# Altium schematic sheet MISC.SchDoc
size A3
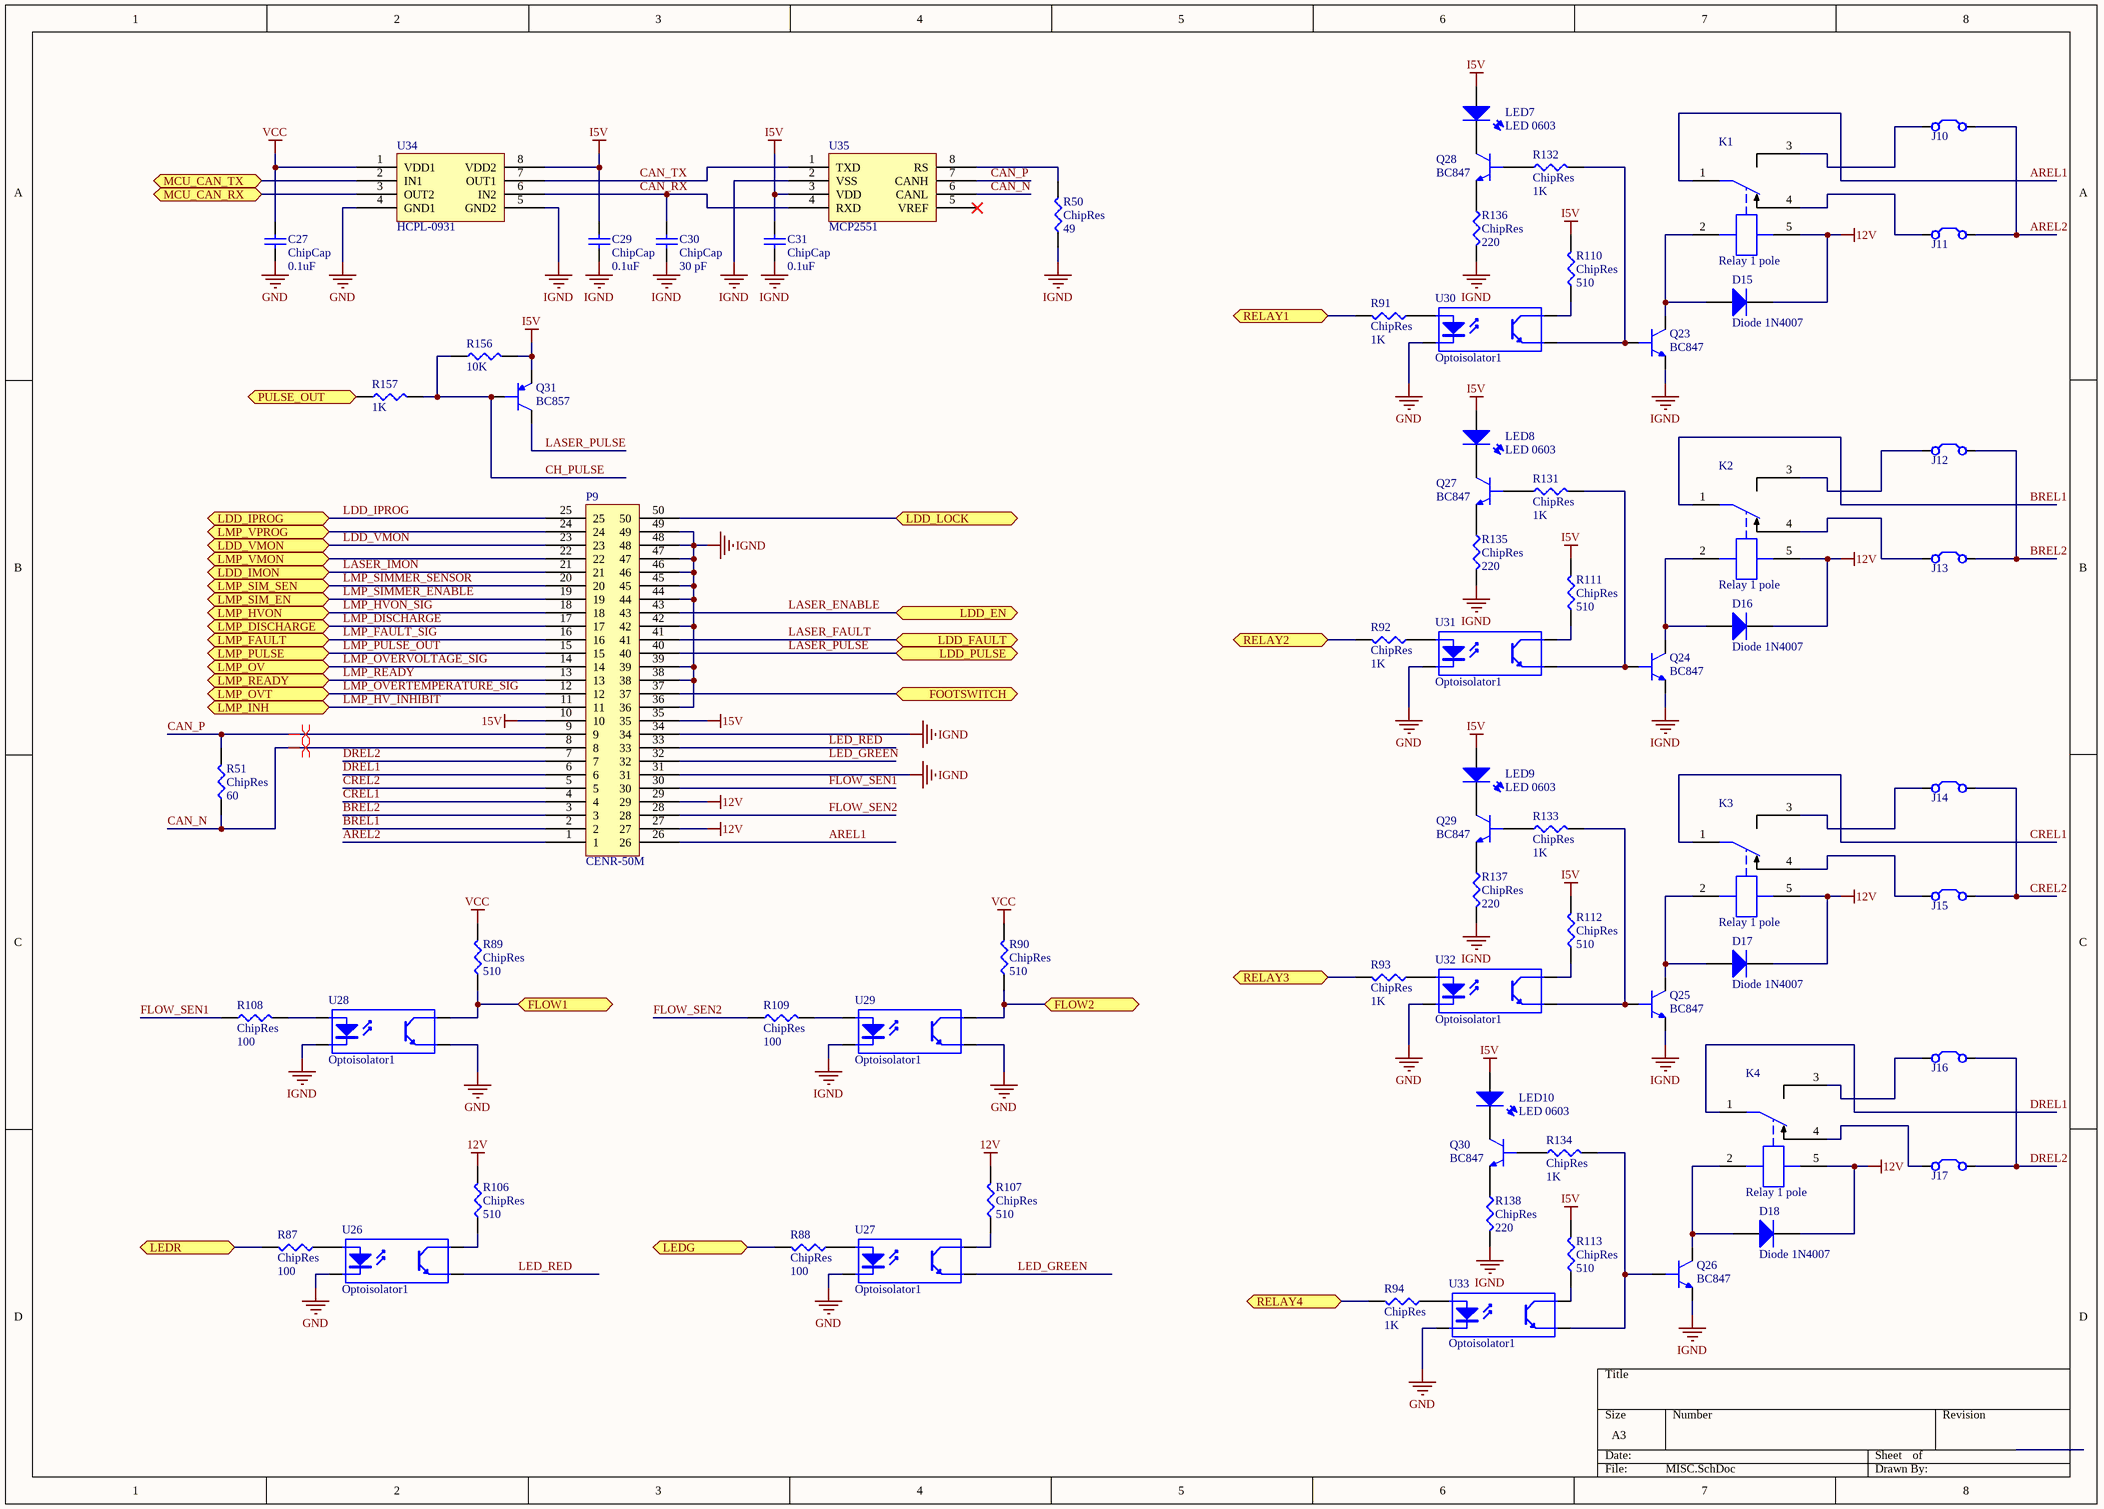
[diagram p0: MISC.SchDoc]

## Parts
C27  ChipCap  value 0.1uF  [CAP0805]
C29  ChipCap  value 0.1uF  [CAP0805]
C30  ChipCap  value 30 pF  [CAP0805]
C31  ChipCap  value 0.1uF  [CAP0805]
D15  Diode 1N4007  [DO-41]
D16  Diode 1N4007  [DO-41]
D17  Diode 1N4007  [DO-41]
D18  Diode 1N4007  [DO-41]
J10  Jumper  [J0805]  (value not drawn)  (net tie, no BOM)
J11  Jumper  [J0805]  (value not drawn)  (net tie, no BOM)
J12  Jumper  [J0805]  (value not drawn)  (net tie, no BOM)
J13  Jumper  [J0805]  (value not drawn)  (net tie, no BOM)
J14  Jumper  [J0805]  (value not drawn)  (net tie, no BOM)
J15  Jumper  [J0805]  (value not drawn)  (net tie, no BOM)
J16  Jumper  [J0805]  (value not drawn)  (net tie, no BOM)
J17  Jumper  [J0805]  (value not drawn)  (net tie, no BOM)
K1  Relay 1 pole  [G5LA]
K2  Relay 1 pole  [G5LA]
K3  Relay 1 pole  [G5LA]
K4  Relay 1 pole  [G5LA]
LED7  LED 0603  [LED 0603]
LED8  LED 0603  [LED 0603]
LED9  LED 0603  [LED 0603]
LED10  LED 0603  [LED 0603]
P9  CENR-50M  [CENR-50M]
Q23  BC847  [SOT23]
Q24  BC847  [SOT23]
Q25  BC847  [SOT23]
Q26  BC847  [SOT23]
Q27  BC847  [SOT23]
Q28  BC847  [SOT23]
Q29  BC847  [SOT23]
Q30  BC847  [SOT23]
Q31  BC857  [SOT23]
R50  ChipRes  value 49  [RES0805]
R51  ChipRes  value 60  [RES0805]
R87  ChipRes  value 100  [RES0805]
R88  ChipRes  value 100  [RES0805]
R89  ChipRes  value 510  [RES0805]
R90  ChipRes  value 510  [RES0805]
R91  ChipRes  value 1K  [RES0805]
R92  ChipRes  value 1K  [RES0805]
R93  ChipRes  value 1K  [RES0805]
R94  ChipRes  value 1K  [RES0805]
R106  ChipRes  value 510  [RES0805]
R107  ChipRes  value 510  [RES0805]
R108  ChipRes  value 100  [RES0805]
R109  ChipRes  value 100  [RES0805]
R110  ChipRes  value 510  [RES0805]
R111  ChipRes  value 510  [RES0805]
R112  ChipRes  value 510  [RES0805]
R113  ChipRes  value 510  [RES0805]
R131  ChipRes  value 1K  [RES0805]
R132  ChipRes  value 1K  [RES0805]
R133  ChipRes  value 1K  [RES0805]
R134  ChipRes  value 1K  [RES0805]
R135  ChipRes  value 220  [RES0805]
R136  ChipRes  value 220  [RES0805]
R137  ChipRes  value 220  [RES0805]
R138  ChipRes  value 220  [RES0805]
R156  value 10K  [RES0805]  (hidden comment: ChipRes)
R157  value 1K  [RES0805]  (hidden comment: ChipRes)
U26  Optoisolator1  [DIP-4]
U27  Optoisolator1  [DIP-4]
U28  Optoisolator1  [DIP-4]
U29  Optoisolator1  [DIP-4]
U30  Optoisolator1  [DIP-4]
U31  Optoisolator1  [DIP-4]
U32  Optoisolator1  [DIP-4]
U33  Optoisolator1  [DIP-4]
U34  HCPL-0931  [SOIC8]
U35  MCP2551  [SOIC8]

## Ports
FLOW1, FLOW2, FOOTSWITCH, LDD_EN, LDD_FAULT, LDD_IMON, LDD_IPROG, LDD_LOCK, LDD_PULSE, LDD_VMON, LEDG, LEDR, LMP_DISCHARGE, LMP_FAULT, LMP_HVON, LMP_INH, LMP_OV, LMP_OVT, LMP_PULSE, LMP_READY, LMP_SIM_EN, LMP_SIM_SEN, LMP_VMON, LMP_VPROG, MCU_CAN_RX, MCU_CAN_TX, PULSE_OUT, RELAY1, RELAY2, RELAY3, RELAY4

## Nets
12V: D15.2(K) D16.2(K) D17.2(K) D18.2(K) K1.5 K2.5 K3.5 K4.5 P9.27 P9.29 R106.2 R107.2
15V: P9.10 P9.35
GND: C27.2 U26.2(K) U27.2(K) U28.3(E) U29.3(E) U30.2(K) U31.2(K) U32.2(K) U33.2(K) U34.4(GND1)
I5V: C29.1 C31.1 LED7.2 LED8.2 LED9.2 LED10.2 Q31.2 R110.2 R111.2 R112.2 R113.2 R156.2 U34.8(VDD2) U35.3(VDD)
IGND: C29.2 C30.2 C31.2 P9.31 P9.34 P9.36 P9.38 P9.39 P9.42 P9.44 P9.45 P9.46 P9.47 P9.48 P9.49 Q23.2 Q24.2 Q25.2 Q26.2 R50.1 R135.1 R136.1 R137.1 R138.1 U28.2(K) U29.2(K) U34.5(GND2) U35.2(VSS)
VCC: C27.1 R89.2 R90.2 U34.1(VDD1)
AREL1: K1.1 P9.26
AREL2: J10.1 J11.1 P9.1
BREL1: K2.1 P9.2
BREL2: J12.1 J13.1 P9.3
CAN_N: P9.8 R51.1 U35.6(CANL)
CAN_P: P9.9 R51.2 U35.7(CANH)
CAN_RX: C30.1 U34.6(IN2) U35.4(RXD)
CAN_TX: U34.7(OUT1) U35.1(TXD)
CH_PULSE: Q31.1 R156.1 R157.2
CREL1: K3.1 P9.4
CREL2: J14.1 J15.1 P9.5
DREL1: K4.1 P9.6
DREL2: J16.1 J17.1 P9.7
FLOW1: R89.1 U28.4(C) ; port FLOW1
FLOW2: R90.1 U29.4(C) ; port FLOW2
FLOW_SEN1: P9.30 R108.2
FLOW_SEN2: P9.28 R109.2
FOOTSWITCH: P9.37 ; port FOOTSWITCH
LASER_ENABLE: P9.43 ; port LDD_EN
LASER_FAULT: P9.41 ; port LDD_FAULT
LASER_IMON: P9.21 ; port LDD_IMON
LASER_PULSE: P9.40 Q31.3 ; port LDD_PULSE
LDD_IPROG: P9.25 ; port LDD_IPROG
LDD_LOCK: P9.50 ; port LDD_LOCK
LDD_VMON: P9.23 ; port LDD_VMON
LED_GREEN: P9.32 U27.3(E)
LED_RED: P9.33 U26.3(E)
LEDG: R88.2 ; port LEDG
LEDR: R87.2 ; port LEDR
LMP_DISCHARGE: P9.17 ; port LMP_DISCHARGE
LMP_FAULT_SIG: P9.16 ; port LMP_FAULT
LMP_HV_INHIBIT: P9.11 ; port LMP_INH
LMP_HVON_SIG: P9.18 ; port LMP_HVON
LMP_OVERTEMPERATURE_SIG: P9.12 ; port LMP_OVT
LMP_OVERVOLTAGE_SIG: P9.14 ; port LMP_OV
LMP_PULSE_OUT: P9.15 ; port LMP_PULSE
LMP_READY: P9.13 ; port LMP_READY
LMP_SIMMER_ENABLE: P9.19 ; port LMP_SIM_EN
LMP_SIMMER_SENSOR: P9.20 ; port LMP_SIM_SEN
LMP_VMON: P9.22 ; port LMP_VMON
LMP_VPROG: P9.24 ; port LMP_VPROG
MCU_CAN_RX: U34.3(OUT2) ; port MCU_CAN_RX
MCU_CAN_TX: U34.2(IN1) ; port MCU_CAN_TX
PULSE_OUT: R157.1 ; port PULSE_OUT
RELAY1: R91.2 ; port RELAY1
RELAY2: R92.2 ; port RELAY2
RELAY3: R93.2 ; port RELAY3
RELAY4: R94.2 ; port RELAY4
NetD15_1: D15.1(A) K1.2 Q23.3
NetD16_1: D16.1(A) K2.2 Q24.3
NetD17_1: D17.1(A) K3.2 Q25.3
NetD18_1: D18.1(A) K4.2 Q26.3
NetJ10_0: J10.0 K1.3
NetJ11_0: J11.0 K1.4
NetJ12_0: J12.0 K2.3
NetJ13_0: J13.0 K2.4
NetJ14_0: J14.0 K3.3
NetJ15_0: J15.0 K3.4
NetJ16_0: J16.0 K4.3
NetJ17_0: J17.0 K4.4
NetLED7_1: LED7.1 Q28.3
NetLED8_1: LED8.1 Q27.3
NetLED9_1: LED9.1 Q29.3
NetLED10_1: LED10.1 Q30.3
NetQ23_1: Q23.1 R132.1 U30.3(E)
NetQ24_1: Q24.1 R131.1 U31.3(E)
NetQ25_1: Q25.1 R133.1 U32.3(E)
NetQ26_1: Q26.1 R134.1 U33.3(E)
NetQ27_1: Q27.1 R131.2
NetQ27_2: Q27.2 R135.2
NetQ28_1: Q28.1 R132.2
NetQ28_2: Q28.2 R136.2
NetQ29_1: Q29.1 R133.2
NetQ29_2: Q29.2 R137.2
NetQ30_1: Q30.1 R134.2
NetQ30_2: Q30.2 R138.2
NetR50_2: R50.2 U35.8(RS)
NetR87_1: R87.1 U26.1(A)
NetR88_1: R88.1 U27.1(A)
NetR91_1: R91.1 U30.1(A)
NetR92_1: R92.1 U31.1(A)
NetR93_1: R93.1 U32.1(A)
NetR94_1: R94.1 U33.1(A)
NetR106_1: R106.1 U26.4(C)
NetR107_1: R107.1 U27.4(C)
NetR108_1: R108.1 U28.1(A)
NetR109_1: R109.1 U29.1(A)
NetR110_1: R110.1 U30.4(C)
NetR111_1: R111.1 U31.4(C)
NetR112_1: R112.1 U32.4(C)
NetR113_1: R113.1 U33.4(C)

Not connected (* = marked no-connect by the designer): U35 5(VREF)*

## Layout directives
differential pair: CAN_N, CAN_P

## Library data of the parts
C27 C29-C31 = ChipCap: Capacitor; Published: 8-Jun-2000; LatestRevisionDate: 17-Jul-2002; LatestRevisionNote: Re-released for DXP Platform.; PackageReference: RAD-0.3; Publisher: Altium Limited
D15-D18 = Diode 1N4007: 1 Amp General Purpose Rectifier; Published: 8-Jun-2000; LatestRevisionDate: 17-Jul-2002; LatestRevisionNote: Re-released for DXP Platform.; DatasheetVersion: 1998; PackageVersion: Aug-1999; PackageReference: DO-41; Publisher: Altium Limited; PackageDescription: Diode, Axial; Body 5.2 x 2.7 mm (LxDia. max), Lead Dia. 0.86 mm (max); Code_JEDEC: DO-204-AL; ComponentLink1Description: Manufacturer Link; ComponentLink1URL: http://www.fairchildsemi.com/; ComponentLink2Description: Datasheet; ComponentLink2URL: http://www.fairchildsemi.com/ds/1N%2F1N4001.pdf
K1-K4 = Relay G5LE: Relay G5LE 10A Single Pole
LED7-LED10 = LED0603
Q23-Q30 = BC847: NPN transistor
Q31 = BC857: PNP Transistor
R50 R51 R87-R94 R106-R113 R131-R138 R156 R157 = ChipRes: Chip resistor
U26-U33 = Optoisolator1: 4-Pin Phototransistor Optocoupler; Published: 24-Mar-1999; LatestRevisionDate: 04-Mar-2005; LatestRevisionNote: Sch pins 3 & 4 Swapped.; DatasheetVersion: Nov-2003; PackageReference: DIP-4; Publisher: Altium Limited
U34 = HCPL-0931-000E: 2-bit bi-direction optoisolated buffer
U35 = MCP2551-I/SN: CAN Transceiver